# Altium schematic sheet NixieFriday.SchDoc
size A2
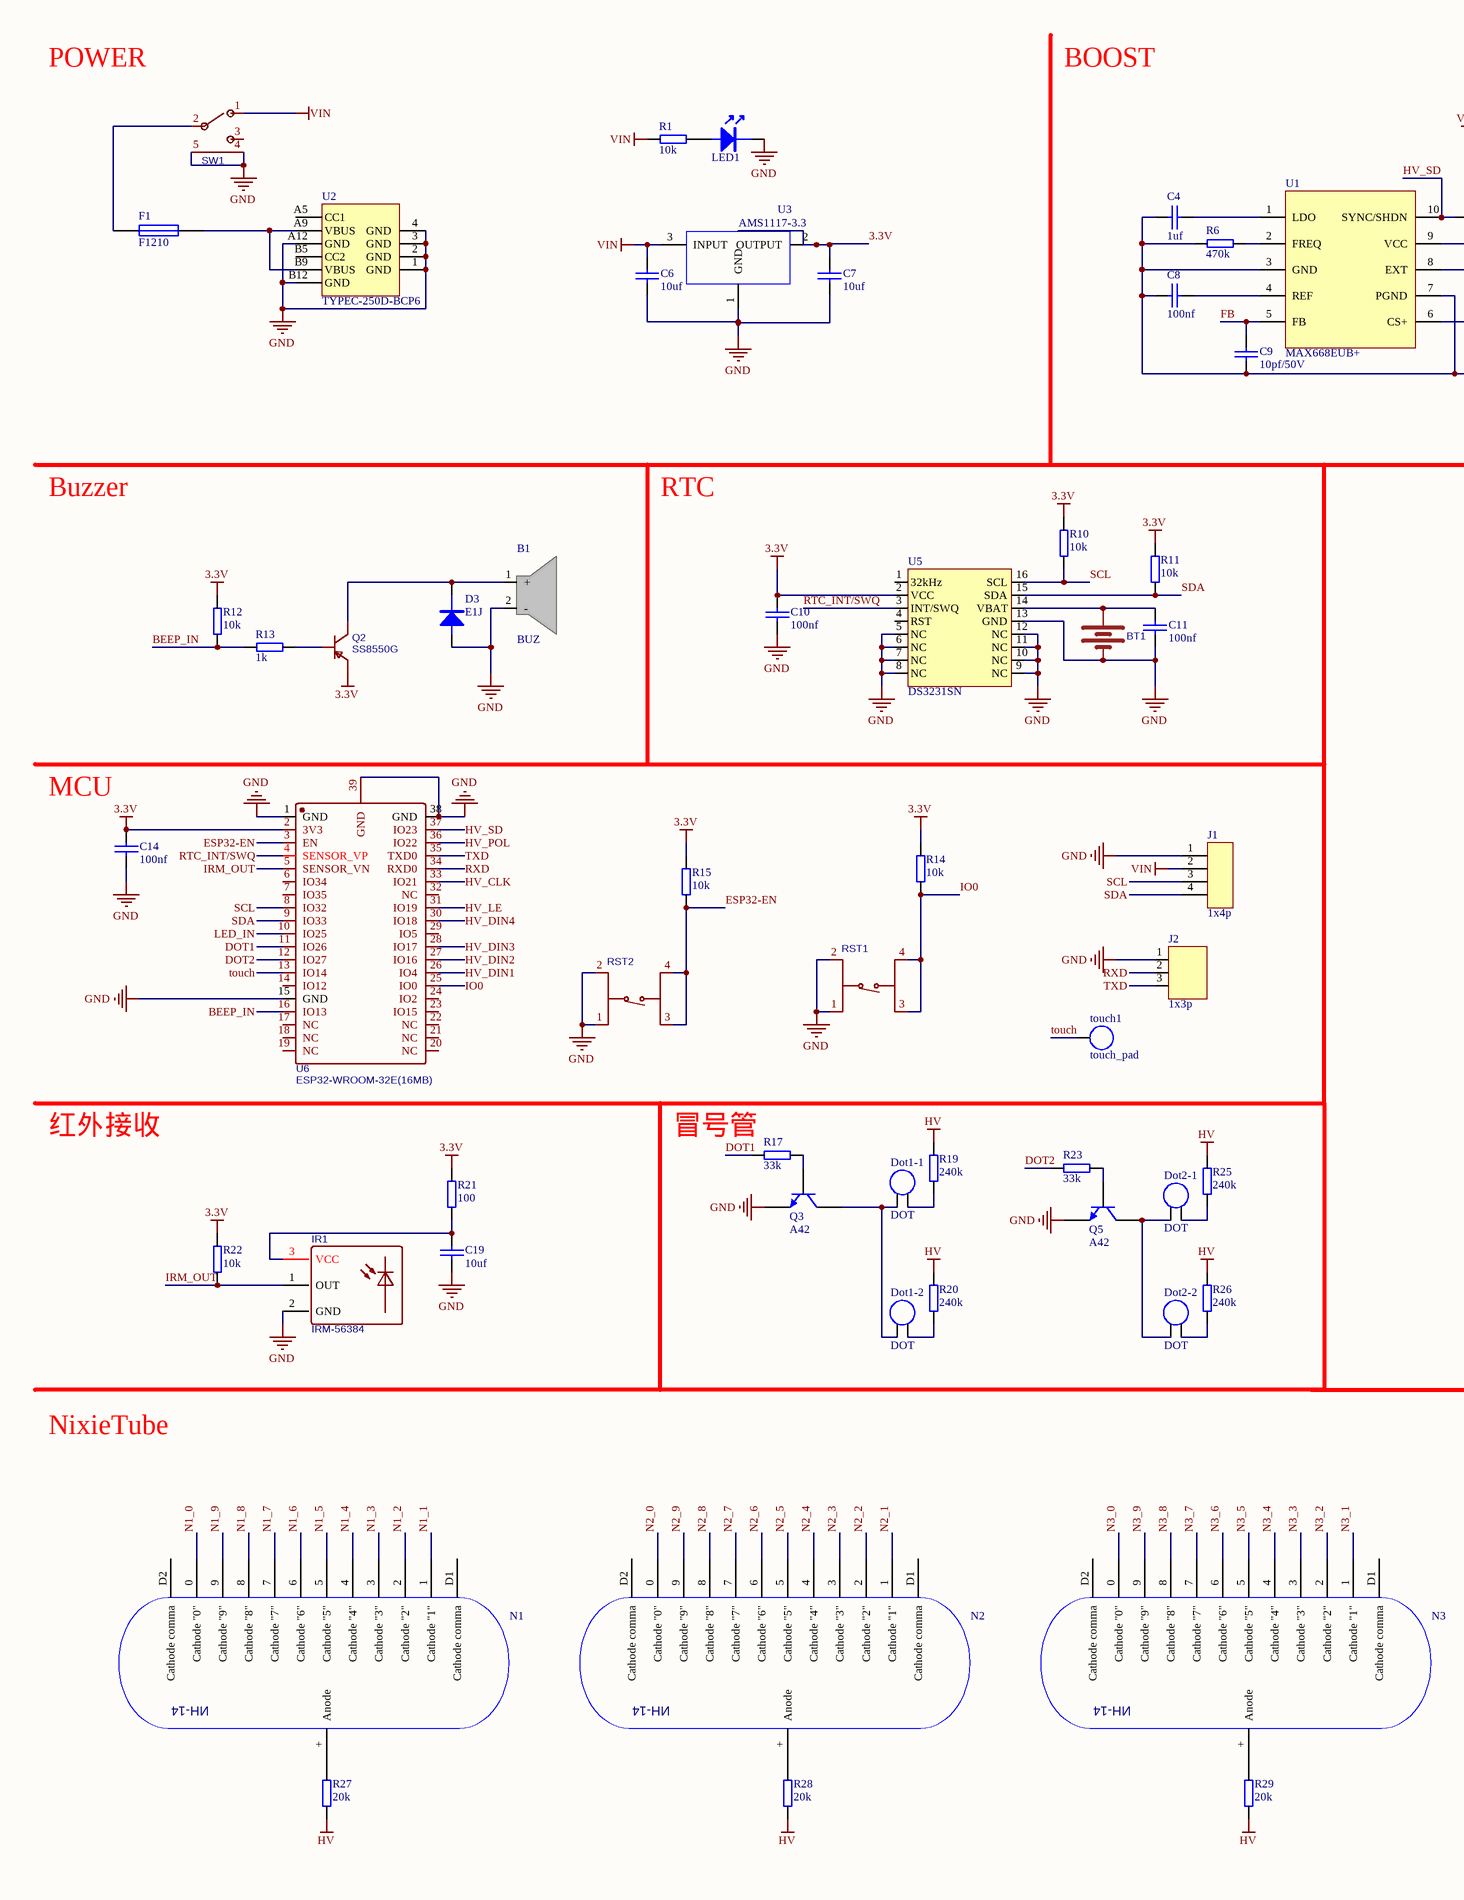
[diagram p0: NixieFriday.SchDoc, left]
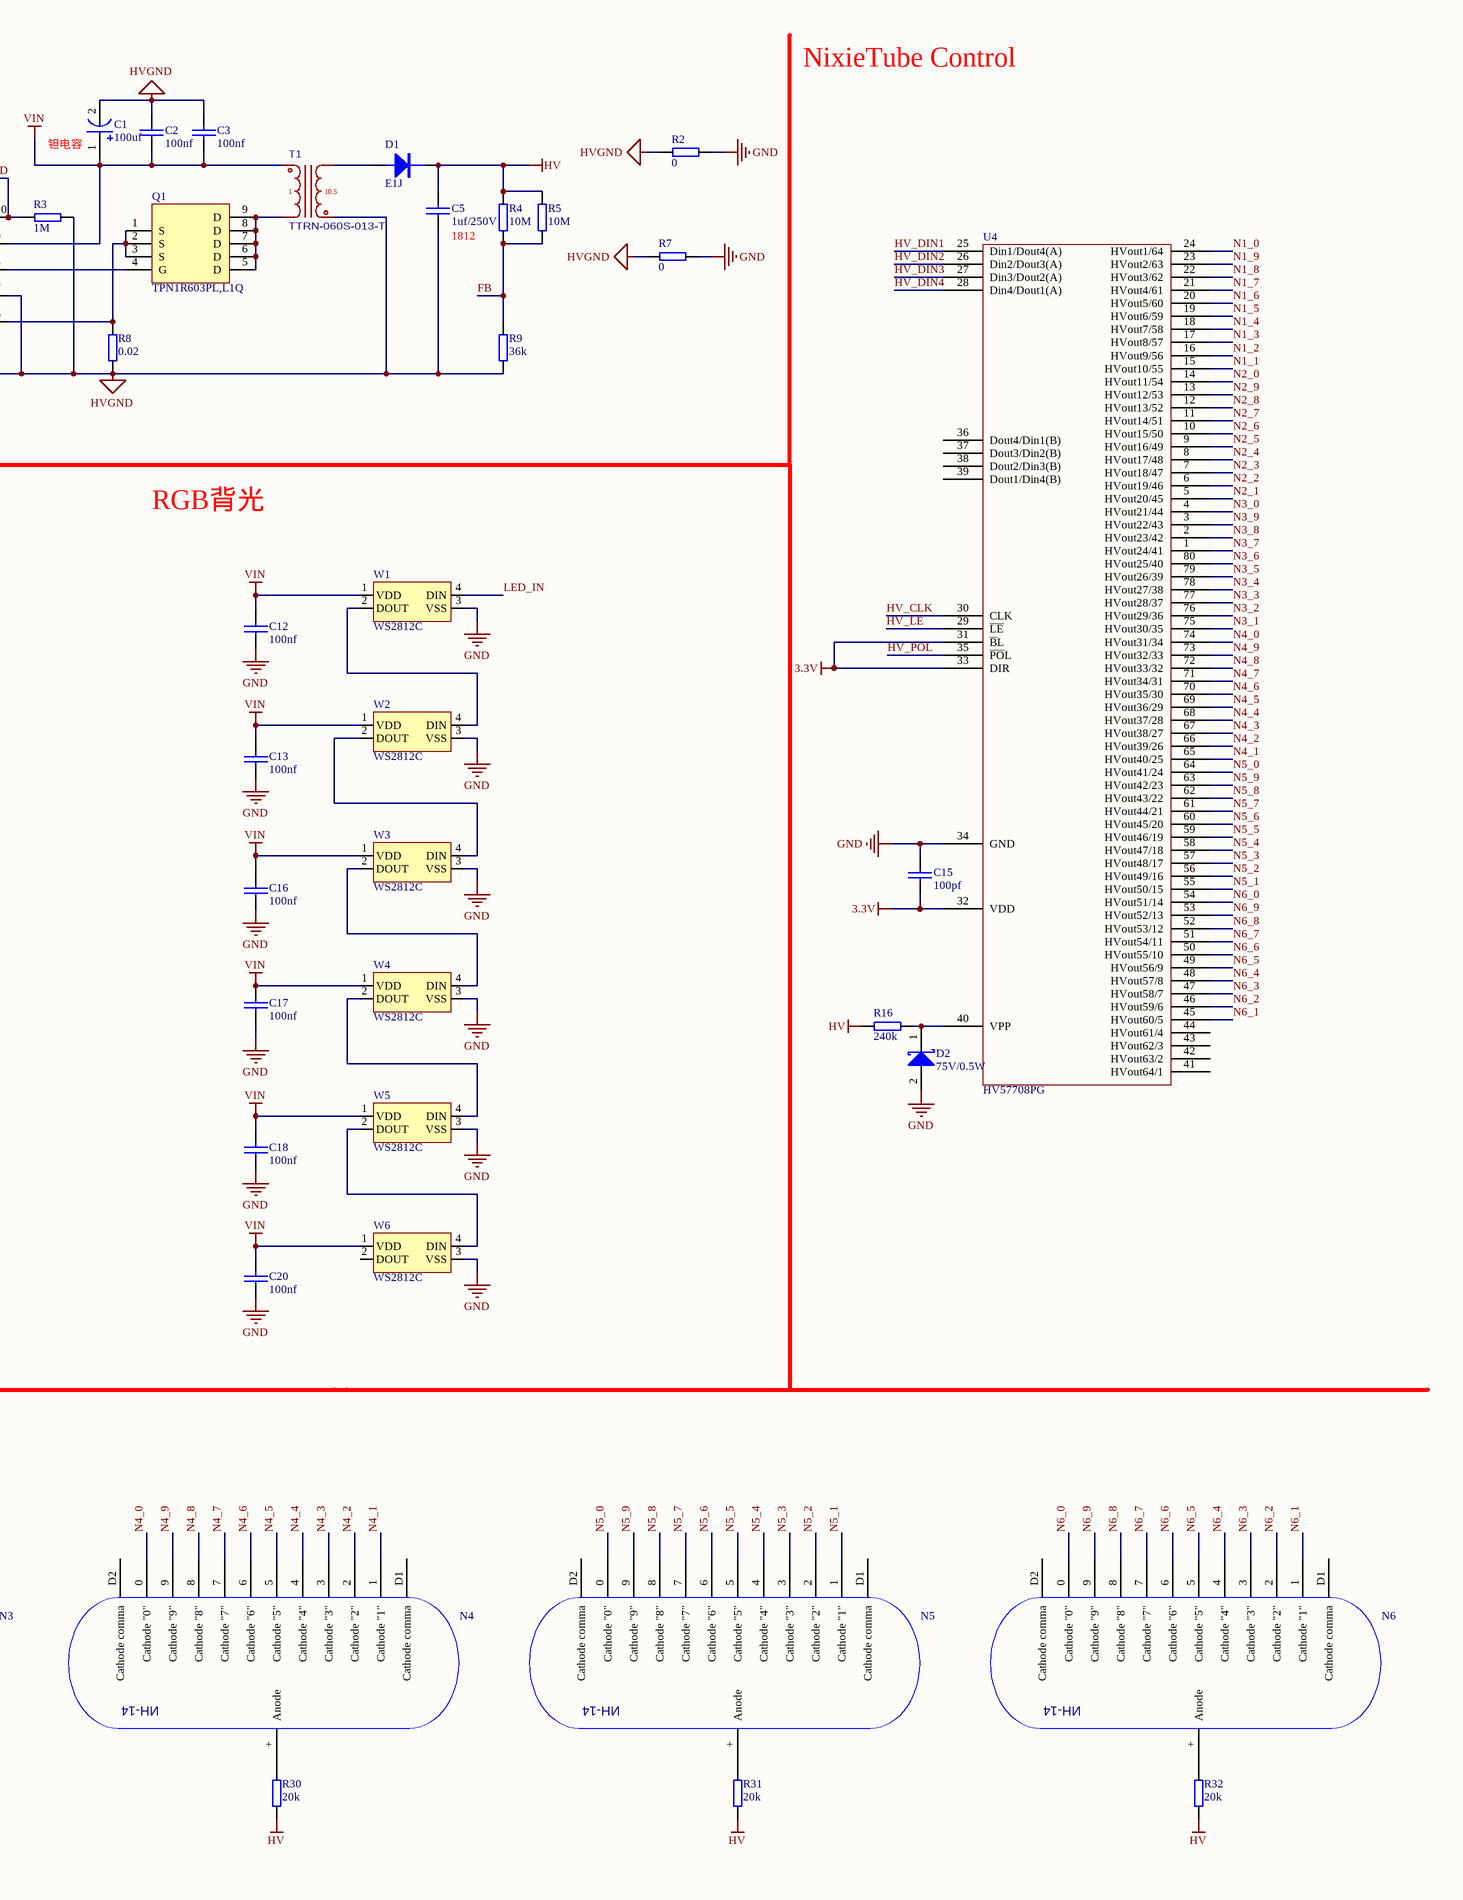
[diagram p1: NixieFriday.SchDoc, right]

## Parts
B1  BUZ  [BUZ-SMD_4P-L8.5-W8.5-TL]
BT1  BS-12-B3AA003  [BAT-SMD_BS-12-B3AA011]  (value not drawn)
C1  100uf  [CAP-SMD_L3.2-W1.6-RD]
C2  100nf  [C0603]
C3  100nf  [C0603]
C4  1uf  [C0603]
C5  1uf/250V  [C1812]
C6  10uf  [C0603]
C7  10uf  [C0603]
C8  100nf  [C0603]
C9  10pf/50V  [C0603]
C10  100nf  [C0603]
C11  100nf  [C0603]
C12  100nf  [C0603]
C13  100nf  [C0603]
C14  100nf  [C0603]
C15  100pf  [C0603]
C16  100nf  [C0603]
C17  100nf  [C0603]
C18  100nf  [C0603]
C19  10uf  [C0603]
C20  100nf  [C0603]
D1  E1J  [SOD-123FL_L2.7-W1.8-LS3.8-RD]
D2  75V/0.5W  [75V二极管]
D3  E1J  [SOD-123FL_L2.7-W1.8-LS3.8-RD]
Dot1-1  DOT  [Neon]
Dot1-2  DOT  [Neon]
Dot2-1  DOT  [Neon]
Dot2-2  DOT  [Neon]
F1  F1210  [F1210]
IR1  IRM-56384  [OPTO-TH_IRM-56384]
J1  1x4p  [1x4p_2.54_弯]
J2  1x3p  [1x3p]
LED1  LED  [LED0603]  (value not drawn)
N1  ИН-14  [NH_14_PIN]  (value not drawn)
N2  ИН-14  [NH_14_PIN]  (value not drawn)
N3  ИН-14  [NH_14_PIN]  (value not drawn)
N4  ИН-14  [NH_14_PIN]  (value not drawn)
N5  ИН-14  [NH_14_PIN]  (value not drawn)
N6  ИН-14  [NH_14_PIN]  (value not drawn)
Q1  TPN1R603PL,L1Q  [PG-TSDSON-8_L3.3-W3.3-P0.65-BL]
Q2  SS8550G  [ss8550g]
Q3  A42  [SOT-23-3]
Q5  A42  [SOT-23-3]
R1  10k  [R0603]
R2  0  [R0805]
R3  1M  [R0603]
R4  10M  [R0805]
R5  10M  [R0805]
R6  470k  [R0603]
R7  0  [R0805]
R8  0.02  [R0805]
R9  36k  [R0805]
R10  10k  [R0603]
R11  10k  [R0603]
R12  10k  [R0603]
R13  1k  [R0603]
R14  10k  [R0603]
R15  10k  [R0603]
R16  240k  [R0805]
R17  33k  [R0603]
R19  240k  [R0805]
R20  240k  [R0805]
R21  100  [R0603]
R22  10k  [R0603]
R23  33k  [R0603]
R25  240k  [R0805]
R26  240k  [R0805]
R27  20k  [R0805]
R28  20k  [R0805]
R29  20k  [R0805]
R30  20k  [R0805]
R31  20k  [R0805]
R32  20k  [R0805]
RST1  1TS001G-1500-1700  [SW-SMD_4P-L5.1-W5.1-P3.70-LS6.5-TL-2]  (value not drawn)
RST2  1TS001G-1500-1700  [SW-SMD_4P-L5.1-W5.1-P3.70-LS6.5-TL-2]  (value not drawn)
SW1  ST-0-102-C03-N003-RS  [钮子开关]  (value not drawn)
T1  TTRN-060S-013-T  [TTRN-060S-013]
touch1  touch_pad  [touch_pad]
U1  MAX668EUB+  [MAX668_MSOP-10]
U2  TYPEC-250D-BCP6  [USB-C-SMD_TYPEC-250D-BCP6]
U3  AMS1117-3.3  [SOT-223]
U4  HV57708PG  [PQFP80]
U5  DS3231SN  [DS3231_SOIC-16]
U6  ESP32-WROOM-32E(16MB)  [WIFI-SMD_ESP32-WROOM-32E]
W1  WS2812C  [LED-SMD_4P-L5.0-W5.0-TL_WS2812B-B]
W2  WS2812C  [LED-SMD_4P-L5.0-W5.0-TL_WS2812B-B]
W3  WS2812C  [LED-SMD_4P-L5.0-W5.0-TL_WS2812B-B]
W4  WS2812C  [LED-SMD_4P-L5.0-W5.0-TL_WS2812B-B]
W5  WS2812C  [LED-SMD_4P-L5.0-W5.0-TL_WS2812B-B]
W6  WS2812C  [LED-SMD_4P-L5.0-W5.0-TL_WS2812B-B]

## Nets
3.3V: C7.2 C10.2 C14.2 C15.2 Q2.2(E) R10.2 R11.2 R12.2 R14.2 R15.2 R21.2 R22.2 U3.2(OUTPUT) U3.4 U4.31(~{B}L) U4.32(VDD) U4.33(DIR) U5.2(VCC) U6.2(3V3)
GND: B1.2(-) BT1.2(-) C6.1 C7.1 C10.1 C11.1 C12.1 C13.1 C14.1 C15.1 C16.1 C17.1 C18.1 C19.2 C20.1 D2.2(K) D3.2 IR1.2(GND) J1.1 J2.1(GND) LED1.2 Q3.2(E) Q5.2(E) R2.1 R7.1 RST1.1(A) RST1.2(B) RST2.1(A) RST2.2(B) SW1.4 SW1.5 U2.1(GND) U2.2(GND) U2.3(GND) U2.4(GND) U2.A12(GND) U2.B12(GND) U3.1(GND) U4.34(GND) U5.5(NC) U5.6(NC) U5.7(NC) U5.8(NC) U5.9(NC) U5.10(NC) U5.11(NC) U5.12(NC) U5.13(GND) U6.1(GND) U6.15(GND) U6.38(GND) U6.39(GND) W1.3(VSS) W2.3(VSS) W3.3(VSS) W4.3(VSS) W5.3(VSS) W6.3(VSS)
HV: C5.2 D1.1 R4.2 R5.2 R16.1 R19.2 R20.2 R25.2 R26.2 R27.1 R28.1 R29.1 R30.1 R31.1 R32.1
HVGND: C1.2 C2.2 C3.2 C4.1 C5.1 C8.1 C9.2 R2.2 R3.1 R6.1 R7.2 R8.1 R9.1 T1.3 U1.3(GND) U1.7(PGND)
VIN: C1.1 C2.1 C3.1 C6.2 C12.2 C13.2 C16.2 C17.2 C18.2 C20.2 J1.2 R1.1 SW1.1 T1.1 U1.9(VCC) U3.3(INPUT) W1.1(VDD) W2.1(VDD) W3.1(VDD) W4.1(VDD) W5.1(VDD) W6.1(VDD)
\: N5.0(Cathode_"0") U4.64(HVout41/24)  [also labelled N5_0]
BEEP_IN: R12.1 R13.2 U6.16(IO13)
DOT1: R17.2 U6.11(IO26)
DOT2: R23.2 U6.12(IO27)
ESP32-EN: R15.1 RST2.3(C) RST2.4(D) U6.3(EN)
FB: C9.1 R4.1 R5.1 R9.2 U1.5(FB)
HV_CLK: U4.30(CLK) U6.33(IO21)
HV_DIN1: U4.25(Din1/Dout4(A)) U6.26(IO4)
HV_DIN2: U4.26(Din2/Dout3(A)) U6.27(IO16)
HV_DIN3: U4.27(Din3/Dout2(A)) U6.28(IO17)
HV_DIN4: U4.28(Din4/Dout1(A)) U6.30(IO18)
HV_LE: U4.29(~{LE}) U6.31(IO19)
HV_POL: U4.35(~{PO}L) U6.36(IO22)
HV_SD: R3.2 U1.10(SYNC/SHDN) U6.37(IO23)
IO0: R14.1 RST1.3(C) RST1.4(D) U6.25(IO0)
IRM_OUT: IR1.1(OUT) R22.1 U6.5(SENSOR_VN)
LED_IN: U6.10(IO25) W1.4(DIN)
N1_0: N1.0(Cathode_"0") U4.24(HVout1/64)
N1_1: N1.1(Cathode_"1") U4.15(HVout10/55)
N1_2: N1.2(Cathode_"2") U4.16(HVout9/56)
N1_3: N1.3(Cathode_"3") U4.17(HVout8/57)
N1_4: N1.4(Cathode_"4") U4.18(HVout7/58)
N1_5: N1.5(Cathode_"5") U4.19(HVout6/59)
N1_6: N1.6(Cathode_"6") U4.20(HVout5/60)
N1_7: N1.7(Cathode_"7") U4.21(HVout4/61)
N1_8: N1.8(Cathode_"8") U4.22(HVout3/62)
N1_9: N1.9(Cathode_"9") U4.23(HVout2/63)
N2_0: N2.0(Cathode_"0") U4.14(HVout11/54)
N2_1: N2.1(Cathode_"1") U4.5(HVout20/45)
N2_2: N2.2(Cathode_"2") U4.6(HVout19/46)
N2_3: N2.3(Cathode_"3") U4.7(HVout18/47)
N2_4: N2.4(Cathode_"4") U4.8(HVout17/48)
N2_5: N2.5(Cathode_"5") U4.9(HVout16/49)
N2_6: N2.6(Cathode_"6") U4.10(HVout15/50)
N2_7: N2.7(Cathode_"7") U4.11(HVout14/51)
N2_8: N2.8(Cathode_"8") U4.12(HVout13/52)
N2_9: N2.9(Cathode_"9") U4.13(HVout12/53)
N3_0: N3.0(Cathode_"0") U4.4(HVout21/44)
N3_1: N3.1(Cathode_"1") U4.75(HVout30/35)
N3_2: N3.2(Cathode_"2") U4.76(HVout29/36)
N3_3: N3.3(Cathode_"3") U4.77(HVout28/37)
N3_4: N3.4(Cathode_"4") U4.78(HVout27/38)
N3_5: N3.5(Cathode_"5") U4.79(HVout26/39)
N3_6: N3.6(Cathode_"6") U4.80(HVout25/40)
N3_7: N3.7(Cathode_"7") U4.1(HVout24/41)
N3_8: N3.8(Cathode_"8") U4.2(HVout23/42)
N3_9: N3.9(Cathode_"9") U4.3(HVout22/43)
N4_0: N4.0(Cathode_"0") U4.74(HVout31/34)
N4_1: N4.1(Cathode_"1") U4.65(HVout40/25)
N4_2: N4.2(Cathode_"2") U4.66(HVout39/26)
N4_3: N4.3(Cathode_"3") U4.67(HVout38/27)
N4_4: N4.4(Cathode_"4") U4.68(HVout37/28)
N4_5: N4.5(Cathode_"5") U4.69(HVout36/29)
N4_6: N4.6(Cathode_"6") U4.70(HVout35/30)
N4_7: N4.7(Cathode_"7") U4.71(HVout34/31)
N4_8: N4.8(Cathode_"8") U4.72(HVout33/32)
N4_9: N4.9(Cathode_"9") U4.73(HVout32/33)
N5_1: N5.1(Cathode_"1") U4.55(HVout50/15)
N5_2: N5.2(Cathode_"2") U4.56(HVout49/16)
N5_3: N5.3(Cathode_"3") U4.57(HVout48/17)
N5_4: N5.4(Cathode_"4") U4.58(HVout47/18)
N5_5: N5.5(Cathode_"5") U4.59(HVout46/19)
N5_6: N5.6(Cathode_"6") U4.60(HVout45/20)
N5_7: N5.7(Cathode_"7") U4.61(HVout44/21)
N5_8: N5.8(Cathode_"8") U4.62(HVout43/22)
N5_9: N5.9(Cathode_"9") U4.63(HVout42/23)
N6_0: N6.0(Cathode_"0") U4.54(HVout51/14)
N6_1: N6.1(Cathode_"1") U4.45(HVout60/5)
N6_2: N6.2(Cathode_"2") U4.46(HVout59/6)
N6_3: N6.3(Cathode_"3") U4.47(HVout58/7)
N6_4: N6.4(Cathode_"4") U4.48(HVout57/8)
N6_5: N6.5(Cathode_"5") U4.49(HVout56/9)
N6_6: N6.6(Cathode_"6") U4.50(HVout55/10)
N6_7: N6.7(Cathode_"7") U4.51(HVout54/11)
N6_8: N6.8(Cathode_"8") U4.52(HVout53/12)
N6_9: N6.9(Cathode_"9") U4.53(HVout52/13)
RTC_INT/SWQ: U5.3(INT/SWQ) U6.4(SENSOR_VP)
RXD: J2.2(TXD) U6.34(RXD0)
SCL: J1.3 R10.1 U5.16(SCL) U6.8(IO32)
SDA: J1.4 R11.1 U5.15(SDA) U6.9(IO33)
touch: touch1.1 U6.13(IO14)
TXD: J2.3(RXD) U6.35(TXD0)
NetB1_1: B1.1(+) D3.1 Q2.3(C)
NetBT1_1: BT1.1(+) C11.2 U5.14(VBAT)
NetC4_2: C4.2 U1.1(LDO)
NetC8_2: C8.2 U1.4(REF)
NetC19_1: C19.1 IR1.3(VCC) R21.1
NetD1_2: D1.2 T1.2
NetD2_1: D2.1(A) R16.2 U4.40(VPP)
NetDot1-1_1: Dot1-1.1 Dot1-2.1 Q3.3(C)
NetDot1-1_2: Dot1-1.2 R19.1
NetDot1-2_2: Dot1-2.2 R20.1
NetDot2-1_1: Dot2-1.1 Dot2-2.1 Q5.3(C)
NetDot2-1_2: Dot2-1.2 R25.1
NetDot2-2_2: Dot2-2.2 R26.1
NetF1_1: F1.1 SW1.2
NetF1_2: F1.2 U2.A9(VBUS) U2.B9(VBUS)
NetLED1_1: LED1.1 R1.2
NetN1_+: N1.+(Anode) R27.2
NetN2_+: N2.+(Anode) R28.2
NetN3_+: N3.+(Anode) R29.2
NetN4_+: N4.+(Anode) R30.2
NetN5_+: N5.+(Anode) R31.2
NetN6_+: N6.+(Anode) R32.2
NetQ1_1: Q1.1(S) Q1.2(S) Q1.3(S) R8.2 U1.6(CS+)
NetQ1_4: Q1.4(G) U1.8(EXT)
NetQ1_5: Q1.5(D) Q1.6(D) Q1.7(D) Q1.8(D) Q1.9(D) T1.5
NetQ2_1: Q2.1(B) R13.1
NetQ3_1: Q3.1(B) R17.1
NetQ5_1: Q5.1(B) R23.1
NetR6_2: R6.2 U1.2(FREQ)
NetW1_2: W1.2(DOUT) W2.4(DIN)
NetW2_2: W2.2(DOUT) W3.4(DIN)
NetW3_2: W3.2(DOUT) W4.4(DIN)
NetW4_2: W4.2(DOUT) W5.4(DIN)
NetW5_2: W5.2(DOUT) W6.4(DIN)

Not connected (* = marked no-connect by the designer): N1 D1(Cathode_comma) D2(Cathode_comma); N2 D1(Cathode_comma) D2(Cathode_comma); N3 D1(Cathode_comma) D2(Cathode_comma); N4 D1(Cathode_comma) D2(Cathode_comma); N5 D1(Cathode_comma) D2(Cathode_comma); N6 D1(Cathode_comma) D2(Cathode_comma); SW1 3; U2 A5(CC1) B5(CC2); U4 36(Dout4/Din1(B)) 37(Dout3/Din2(B)) 38(Dout2/Din3(B)) 39(Dout1/Din4(B)) 41(HVout64/1) 42(HVout63/2) 43(HVout62/3) 44(HVout61/4); U5 1(32kHz) 4(RST); U6 6(IO34) 7(IO35) 14(IO12) 17(NC) 18(NC) 19(NC) 20(NC) 21(NC) 22(NC) 23(IO15) 24(IO2) 29(IO5) 32(NC); W6 2(DOUT)

## Notes on the sheet
- POWER
- BOOST
- NixieTube Control
- (near C1) 钽电容
- 1812
- Buzzer
- RTC
- RGB背光
- MCU
- 红外接收
- (near R17) 冒号管
- NixieTube
- (in symbol TTRN-060S-013-T) 10.5

## Library data of the parts
B1 = BUZ: 蜂鸣器
BT1 = BS-12-B3AA003: 纽扣电池; BOM_Manufacturer: MYOUNG(美阳); Contributor: LCSC; BOM_Supplier: LCSC; BOM_Supplier Part: C964723; BOM_Manufacturer Part: BS-12-B3AA003; BOM_JLCPCB Part Class: Extended Part; spicePre: B; spiceSymbolName: BS-12-B3AA003
C1 = Cap_pol: 极性电容
C2-C20 = Cap: 电容
D2 = Diode 10TQ040: Schottky Rectifier; Note: Terminal 2 is the TAB and is electrically connected to the cathode; Published: 8-Jun-2000; LatestRevisionDate: 17-Jul-2002; LatestRevisionNote: Re-released for DXP Platform.; DatasheetVersion: PD-2.057B; PackageVersion: Feb-1998; PackageReference: TO-220AC; Publisher: Altium Limited; PackageDescription: TO, Thru-Hole, Vertical, Heatsink Mounted; 3 In-Line Leads (1 Absent); Pitch 2.54 mm; ComponentLink1Description: Manufacturer Link; ComponentLink1URL: http://www.irf.com/
Dot1-1 Dot1-2 Dot2-1 Dot2-2 = DOT: 4x10mm氖泡
IR1 = IRM-56384: 红外接收管; BOM_Manufacturer: EVERLIGHT; BOM_Supplier: LCSC; BOM_Manufacturer Part: IRM-56384; BOM_Supplier Part: C72048; BOM_JLCPCB Part Class: Extended Part; spicePre: I; spiceSymbolName: IRM-56384
J1 = 1x4p: 2.54mm
LED1 = LED: LED发光管
Q2 = SS8550G: BOM_Manufacturer: Galaxy; Contributor: LCSC; BOM_Supplier: LCSC; BOM_Supplier Part: C380931; BOM_Manufacturer Part: SS8550G; BOM_JLCPCB Part Class: Extended Part; spicePre: Q; spiceSymbolName: SS8550G
Q3 Q5 = 2N3904: NPN General Purpose Amplifier; Published: 8-Jun-2000; LatestRevisionDate: 15-Jan-2003; LatestRevisionNote: PCB Footprint 'BCY-W3/D4.7' replaced; DatasheetVersion: 1997; PackageVersion: Sep-1998; PackageReference: TO-92A; Publisher: Altium Limited; PackageDescription: TO, Flat Index; 3 In-Line, Axial Leads; Body Dia. 4.5mm; Leads 0.51 x 0.48 mm (max); ComponentLink1Description: Manufacturer Link; ComponentLink1URL: http://www.fairchildsemi.com/; ComponentLink2Description: Datasheet; ComponentLink2URL: http://www.fairchildsemi.com/ds/2N%2F2N3904.pdf
R1-R17 R19-R23 R25-R32 = R: 电阻
RST1 RST2 = 1TS001G-1500-1700: BOM_Manufacturer: HYP; Contributor: LCSC; BOM_Supplier: LCSC; BOM_Supplier Part: C318801; BOM_Manufacturer Part: 1TS001G-1500-1700; BOM_JLCPCB Part Class: Extended Part; spicePre: S; spiceSymbolName: 1TS001G-1500-1700
SW1 = 钮子开关: BOM_Manufacturer: YUEN FUNG(源丰); Contributor: LCSC; BOM_Supplier: LCSC; BOM_Supplier Part: C1788489; BOM_Manufacturer Part: ST-0-102-C03-N003-RS; BOM_JLCPCB Part Class: Extended Part; spicePre: S; spiceSymbolName: ST-0-102-C03-N003-RS
U2 = TYPEC-250D-BCP6: TypeC母座
U5 = DS3231SN: RTC芯片
U6 = ESP32-WROOM-32E(16MB): BOM_Manufacturer: Espressif Systems; Contributor: LCSC; BOM_Supplier: LCSC; BOM_Supplier Part: C701343; BOM_Manufacturer Part: ESP32-WROOM-32E(16MB); BOM_JLCPCB Part Class: Extended Part; spicePre: U; spiceSymbolName: ESP32-WROOM-32E(16MB)
F1 = F1210: Published: 8-Jun-2000; LatestRevisionDate: 17-Jul-2002; LatestRevisionNote: Re-released for DXP Platform.; PackageReference: PIN-W2/E2.8; Publisher: Altium Limited; PackageDescription: Thru-Hole; 2 Leads